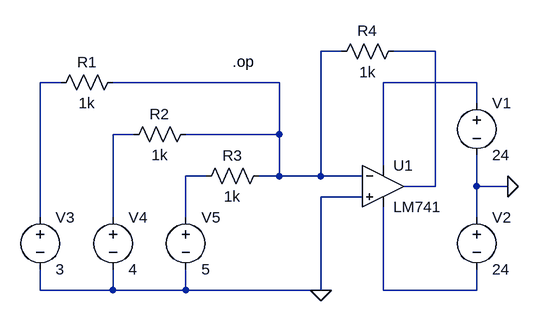
[diagram p0: schematic 8-sum.asc]
8-sum.asc, the LTspice schematic file:
Version 4.1
SHEET 1 880 680
WIRE 96 -48 64 -48
WIRE 240 -48 176 -48
WIRE -336 0 -368 0
WIRE 0 0 -256 0
WIRE 304 0 160 0
WIRE 304 32 304 0
WIRE -224 80 -256 80
WIRE 0 80 0 0
WIRE 0 80 -144 80
WIRE 160 128 160 0
WIRE -112 144 -144 144
WIRE 0 144 0 80
WIRE 0 144 -32 144
WIRE 64 144 64 -48
WIRE 64 144 0 144
WIRE 128 144 64 144
WIRE 240 160 240 -48
WIRE 240 160 192 160
WIRE 304 160 304 112
WIRE 352 160 304 160
WIRE 128 176 64 176
WIRE -368 208 -368 0
WIRE -256 208 -256 80
WIRE -144 208 -144 144
WIRE 304 208 304 160
WIRE -368 320 -368 288
WIRE -256 320 -256 288
WIRE -256 320 -368 320
WIRE -144 320 -144 288
WIRE -144 320 -256 320
WIRE 64 320 -144 320
WIRE 64 320 64 176
WIRE 160 320 160 192
WIRE 304 320 304 288
WIRE 304 320 160 320
FLAG 352 160 0
FLAG 64 320 0
SYMBOL LM741 160 96 R0
SYMATTR InstName U1
SYMBOL voltage 304 16 R0
SYMATTR InstName V1
SYMATTR Value 24
SYMBOL voltage 304 192 R0
SYMATTR InstName V2
SYMATTR Value 24
SYMBOL voltage -368 192 R0
SYMATTR InstName V3
SYMATTR Value 3
SYMBOL voltage -256 192 R0
SYMATTR InstName V4
SYMATTR Value 4
SYMBOL voltage -144 192 R0
SYMATTR InstName V5
SYMATTR Value 5
SYMBOL res -240 -16 R90
WINDOW 0 0 56 VBottom 2
WINDOW 3 32 56 VTop 2
SYMATTR InstName R1
SYMATTR Value 1k
SYMBOL res -128 64 R90
WINDOW 0 0 56 VBottom 2
WINDOW 3 32 56 VTop 2
SYMATTR InstName R2
SYMATTR Value 1k
SYMBOL res -16 128 R90
WINDOW 0 0 56 VBottom 2
WINDOW 3 32 56 VTop 2
SYMATTR InstName R3
SYMATTR Value 1k
SYMBOL res 192 -64 R90
WINDOW 0 0 56 VBottom 2
WINDOW 3 32 56 VTop 2
SYMATTR InstName R4
SYMATTR Value 1k
TEXT -72 -32 Left 2 !.op

The netlist it stands for:
* 8-sum.asc
X§U1 0 N001 N004 N007 N002 LM741  ; pins In+ In- V+ V- OUT
V1 N004 0 24
V2 0 N007 24
V3 N003 0 3
V4 N005 0 4
V5 N006 0 5
R1 N001 N003 1k
R2 N001 N005 1k
R3 N001 N006 1k
R4 N002 N001 1k
.op
.lib LM741.lib
.backanno
.end